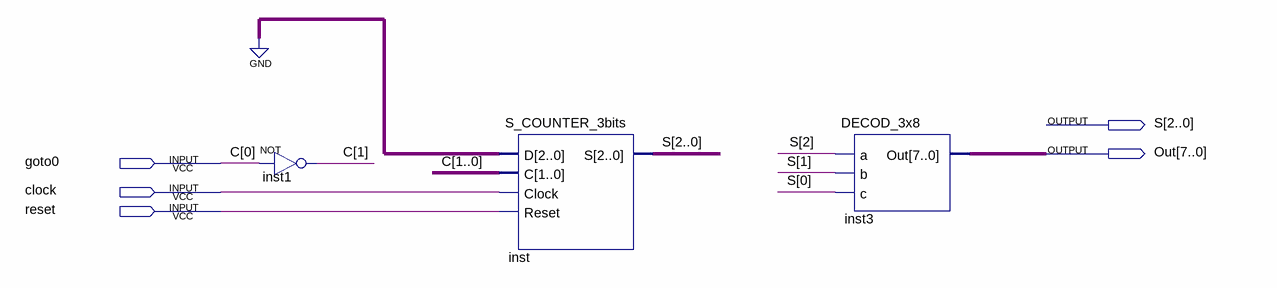
[diagram p0: schematic sheet]
// Quartus schematic TIMER.bdf as structural Verilog: 3 symbols, 5 pins
module TIMER (
  input  goto0,
  input  clock,
  input  reset,
  output [2:0] S,
  output [7:0] Out
);

  wire [1:1] C;

  not inst1 (C[1], goto0);
  S_COUNTER_3bits inst (.D(3'b000), .C({C[1], goto0}), .Clock(clock), .Reset(reset), .S(S));
  DECOD_3x8 inst3 (.a(S[2]), .b(S[1]), .c(S[0]), .Out(Out));

  // Other names for the same wires on the sheet: C[0] = goto0
endmodule
